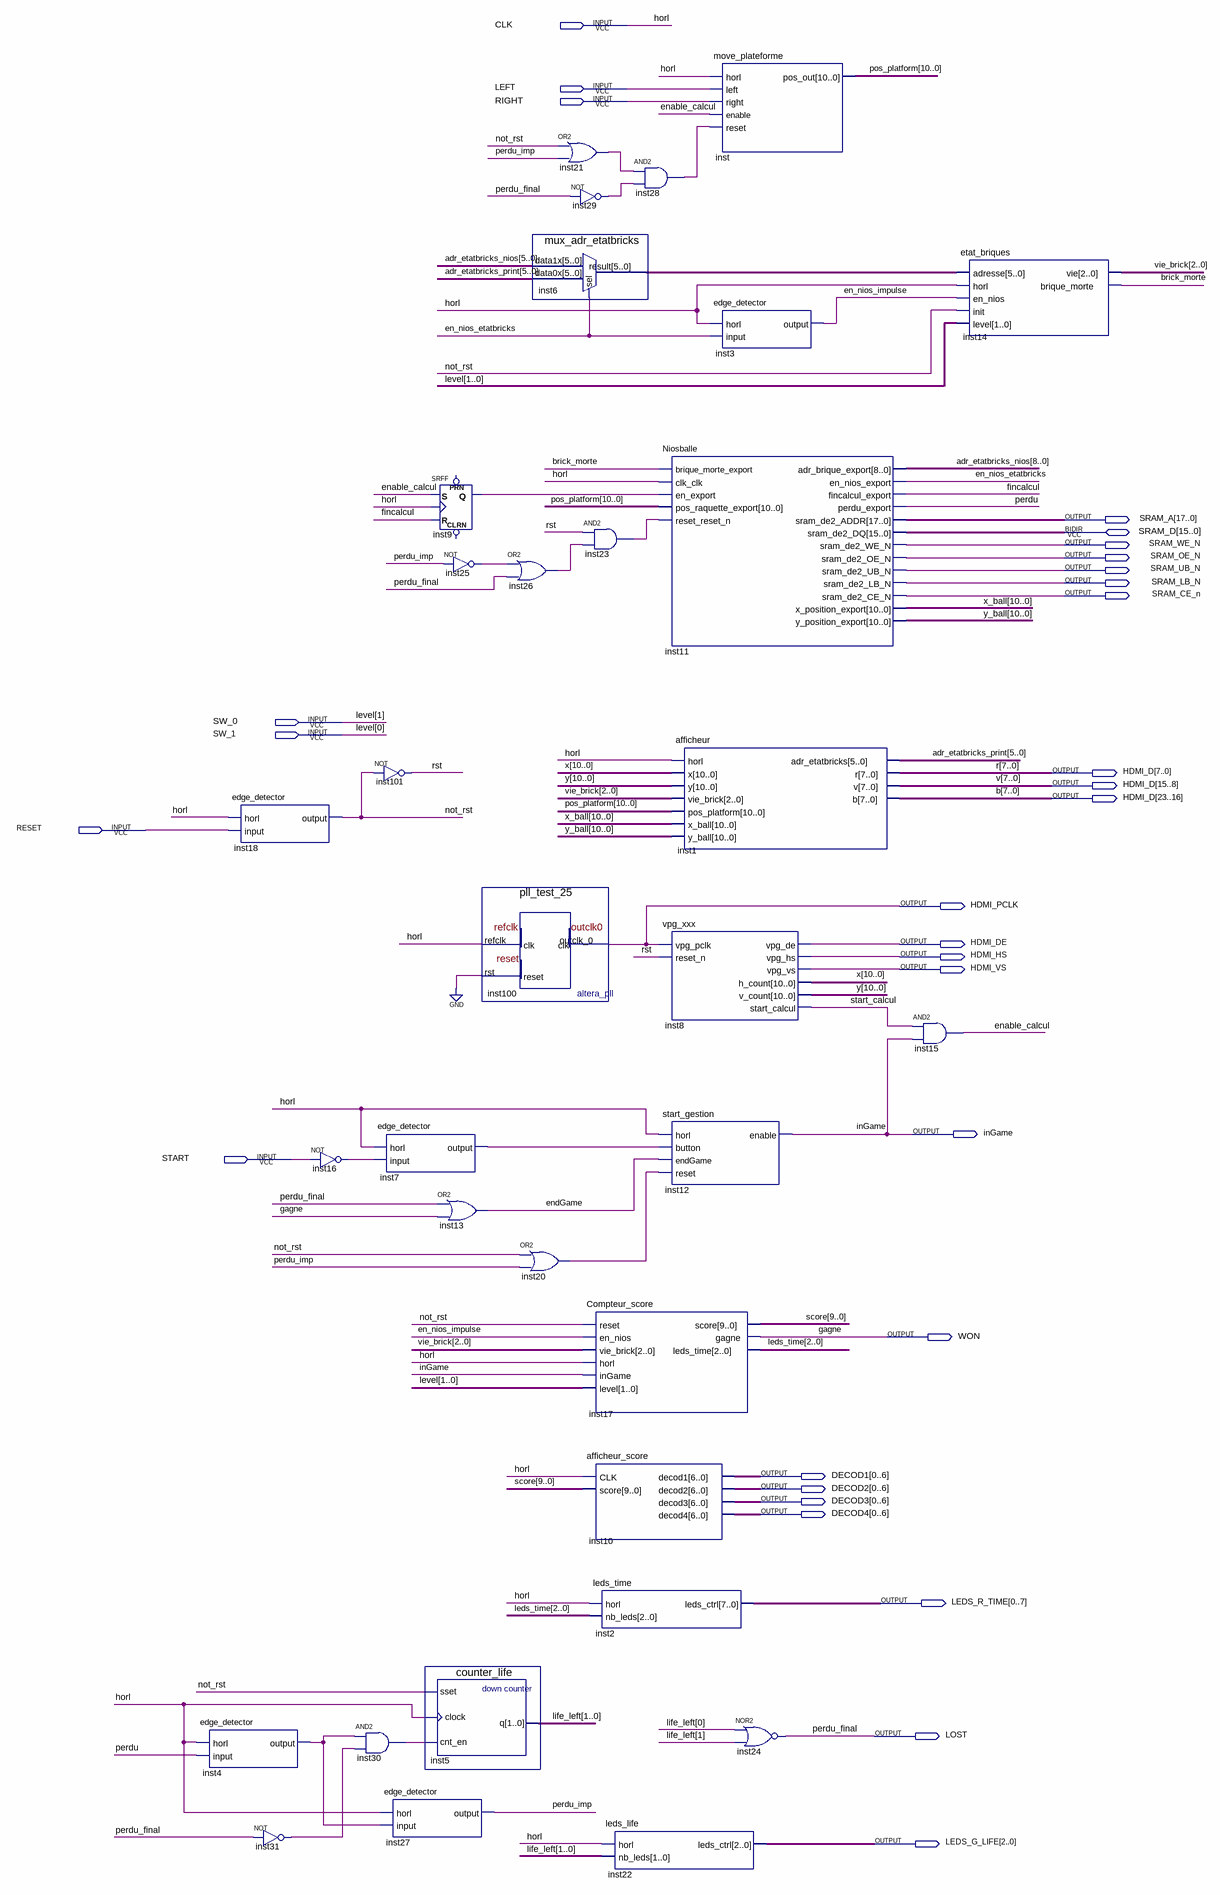
[diagram p0: schematic sheet]
// Quartus schematic main.bdf as structural Verilog: 33 symbols, 30 pins
module main (
  input  CLK,
  input  LEFT,
  input  RIGHT,
  input  SW_0,
  input  SW_1,
  input  RESET,
  input  START,
  inout  [15:0] SRAM_D,
  output [17:0] SRAM_A,
  output SRAM_WE_N,
  output SRAM_OE_N,
  output SRAM_UB_N,
  output SRAM_LB_N,
  output SRAM_CE_n,
  output [23:0] HDMI_D,
  output HDMI_PCLK,
  output HDMI_DE,
  output HDMI_HS,
  output HDMI_VS,
  output inGame,
  output WON,
  output [0:6] DECOD1,
  output [0:6] DECOD2,
  output [0:6] DECOD3,
  output [0:6] DECOD4,
  output [0:7] LEDS_R_TIME,
  output LOST,
  output [2:0] LEDS_G_LIFE
);

  wire brick_morte, en_nios_etatbricks, en_nios_impulse, enable_calcul, endGame, fincalcul, inst4_output,
       inst7_output, inst9_q, inst16_out, inst20_out, inst21_out, inst23_out, inst25_out, inst26_out,
       inst28_out, inst29_out, inst30_out, inst31_out, not_rst, perdu, perdu_imp, rst, start_calcul;
  wire [1:0] life_left;
  wire [2:0] leds_time, vie_brick;
  wire [5:0] adr_etatbricks_print, inst6_result;
  wire [8:0] adr_etatbricks_nios;
  wire [9:0] score;
  wire [10:0] pos_platform, x, x_ball, y, y_ball;

  edge_detector inst18 (.horl(CLK), .\input (RESET), .\output (not_rst));
  edge_detector inst4 (.horl(CLK), .\input (perdu), .\output (inst4_output));
  not inst31 (inst31_out, LOST);
  not inst16 (inst16_out, START);
  not inst101 (rst, not_rst);
  edge_detector inst7 (.horl(CLK), .\input (inst16_out), .\output (inst7_output));
  and inst30 (inst30_out, inst4_output, inst31_out);
  edge_detector inst27 (.horl(CLK), .\input (inst4_output), .\output (perdu_imp));
  SRFF inst9 (.S(enable_calcul), .R(fincalcul), .CLK(CLK), .Q(inst9_q));  // open: PRN, CLRN
  counter_life inst5 (.sset(not_rst), .clock(CLK), .cnt_en(inst30_out), .q(life_left));
  not inst25 (inst25_out, perdu_imp);
  pll_test_25 inst100 (.refclk(CLK), .rst(1'b0), .outclk_0(HDMI_PCLK));
  or inst13 (endGame, LOST, WON);
  mux_adr_etatbricks inst6 (
    .data1x(adr_etatbricks_nios[5:0]), .data0x(adr_etatbricks_print), .sel(en_nios_etatbricks),
    .result(inst6_result));
  or inst26 (inst26_out, inst25_out, LOST);
  or inst20 (inst20_out, not_rst, perdu_imp);
  or inst21 (inst21_out, not_rst, perdu_imp);
  not inst29 (inst29_out, LOST);
  and inst23 (inst23_out, rst, inst26_out);
  Compteur_score inst17 (
    .reset(not_rst), .en_nios(en_nios_impulse), .vie_brick(vie_brick), .horl(CLK), .inGame(inGame),
    .level({SW_0, SW_1}), .score(score), .gagne(WON), .leds_time(leds_time));
  afficheur_score inst10 (.CLK(CLK), .score(score), .decod1(DECOD1), .decod2(DECOD2), .decod3(DECOD3), .decod4(DECOD4));
  and inst28 (inst28_out, inst21_out, inst29_out);
  leds_time inst2 (.horl(CLK), .nb_leds(leds_time), .leds_ctrl(LEDS_R_TIME));
  leds_life inst22 (.horl(CLK), .nb_leds(life_left), .leds_ctrl(LEDS_G_LIFE));
  Niosballe inst11 (
    .brique_morte_export(brick_morte), .clk_clk(CLK), .en_export(inst9_q),
    .pos_raquette_export(pos_platform), .reset_reset_n(inst23_out), .adr_brique_export(adr_etatbricks_nios),
    .en_nios_export(en_nios_etatbricks), .fincalcul_export(fincalcul), .perdu_export(perdu),
    .sram_de2_ADDR(SRAM_A), .sram_de2_WE_N(SRAM_WE_N), .sram_de2_OE_N(SRAM_OE_N), .sram_de2_UB_N(SRAM_UB_N),
    .sram_de2_LB_N(SRAM_LB_N), .sram_de2_CE_N(SRAM_CE_n), .x_position_export(x_ball),
    .y_position_export(y_ball), .sram_de2_DQ(SRAM_D));
  afficheur inst1 (
    .horl(CLK), .x(x), .y(y), .vie_brick(vie_brick), .pos_platform(pos_platform), .x_ball(x_ball),
    .y_ball(y_ball), .adr_etatbricks(adr_etatbricks_print), .r(HDMI_D[7:0]), .v(HDMI_D[15:8]),
    .b(HDMI_D[23:16]));
  vpg_xxx inst8 (
    .vpg_pclk(HDMI_PCLK), .reset_n(rst), .vpg_de(HDMI_DE), .vpg_hs(HDMI_HS), .vpg_vs(HDMI_VS), .h_count(x),
    .v_count(y), .start_calcul(start_calcul));
  start_gestion inst12 (.horl(CLK), .button(inst7_output), .endGame(endGame), .reset(inst20_out), .enable(inGame));
  move_plateforme inst (
    .horl(CLK), .left(LEFT), .right(RIGHT), .enable(enable_calcul), .reset(inst28_out), .pos_out(pos_platform));
  edge_detector inst3 (.horl(CLK), .\input (en_nios_etatbricks), .\output (en_nios_impulse));
  nor inst24 (LOST, life_left[0], life_left[1]);
  and inst15 (enable_calcul, start_calcul, inGame);
  etat_briques inst14 (
    .adresse(inst6_result), .horl(CLK), .en_nios(en_nios_impulse), .init(not_rst), .level({SW_0, SW_1}),
    .vie(vie_brick), .brique_morte(brick_morte));

  // Other names for the same wires on the sheet: b[7:0] = HDMI_D[23:16]; gagne = WON; horl = CLK;
  //   level[1:0] = {SW_0, SW_1}; perdu_final = LOST; r[7:0] = HDMI_D[7:0]; v[7:0] = HDMI_D[15:8]
endmodule
